# Altium schematic sheet CONNECTOR_B.SchDoc: =project_title
size Tabloid; CompanyName: Luxonis Holding; Organization: Luxonis Holding; Address1: 1925 Harmony Park Drive; Address2: Westminster, CO; Address3: 80234; Address4: United States; SheetNumber: 6; SheetTotal: 15
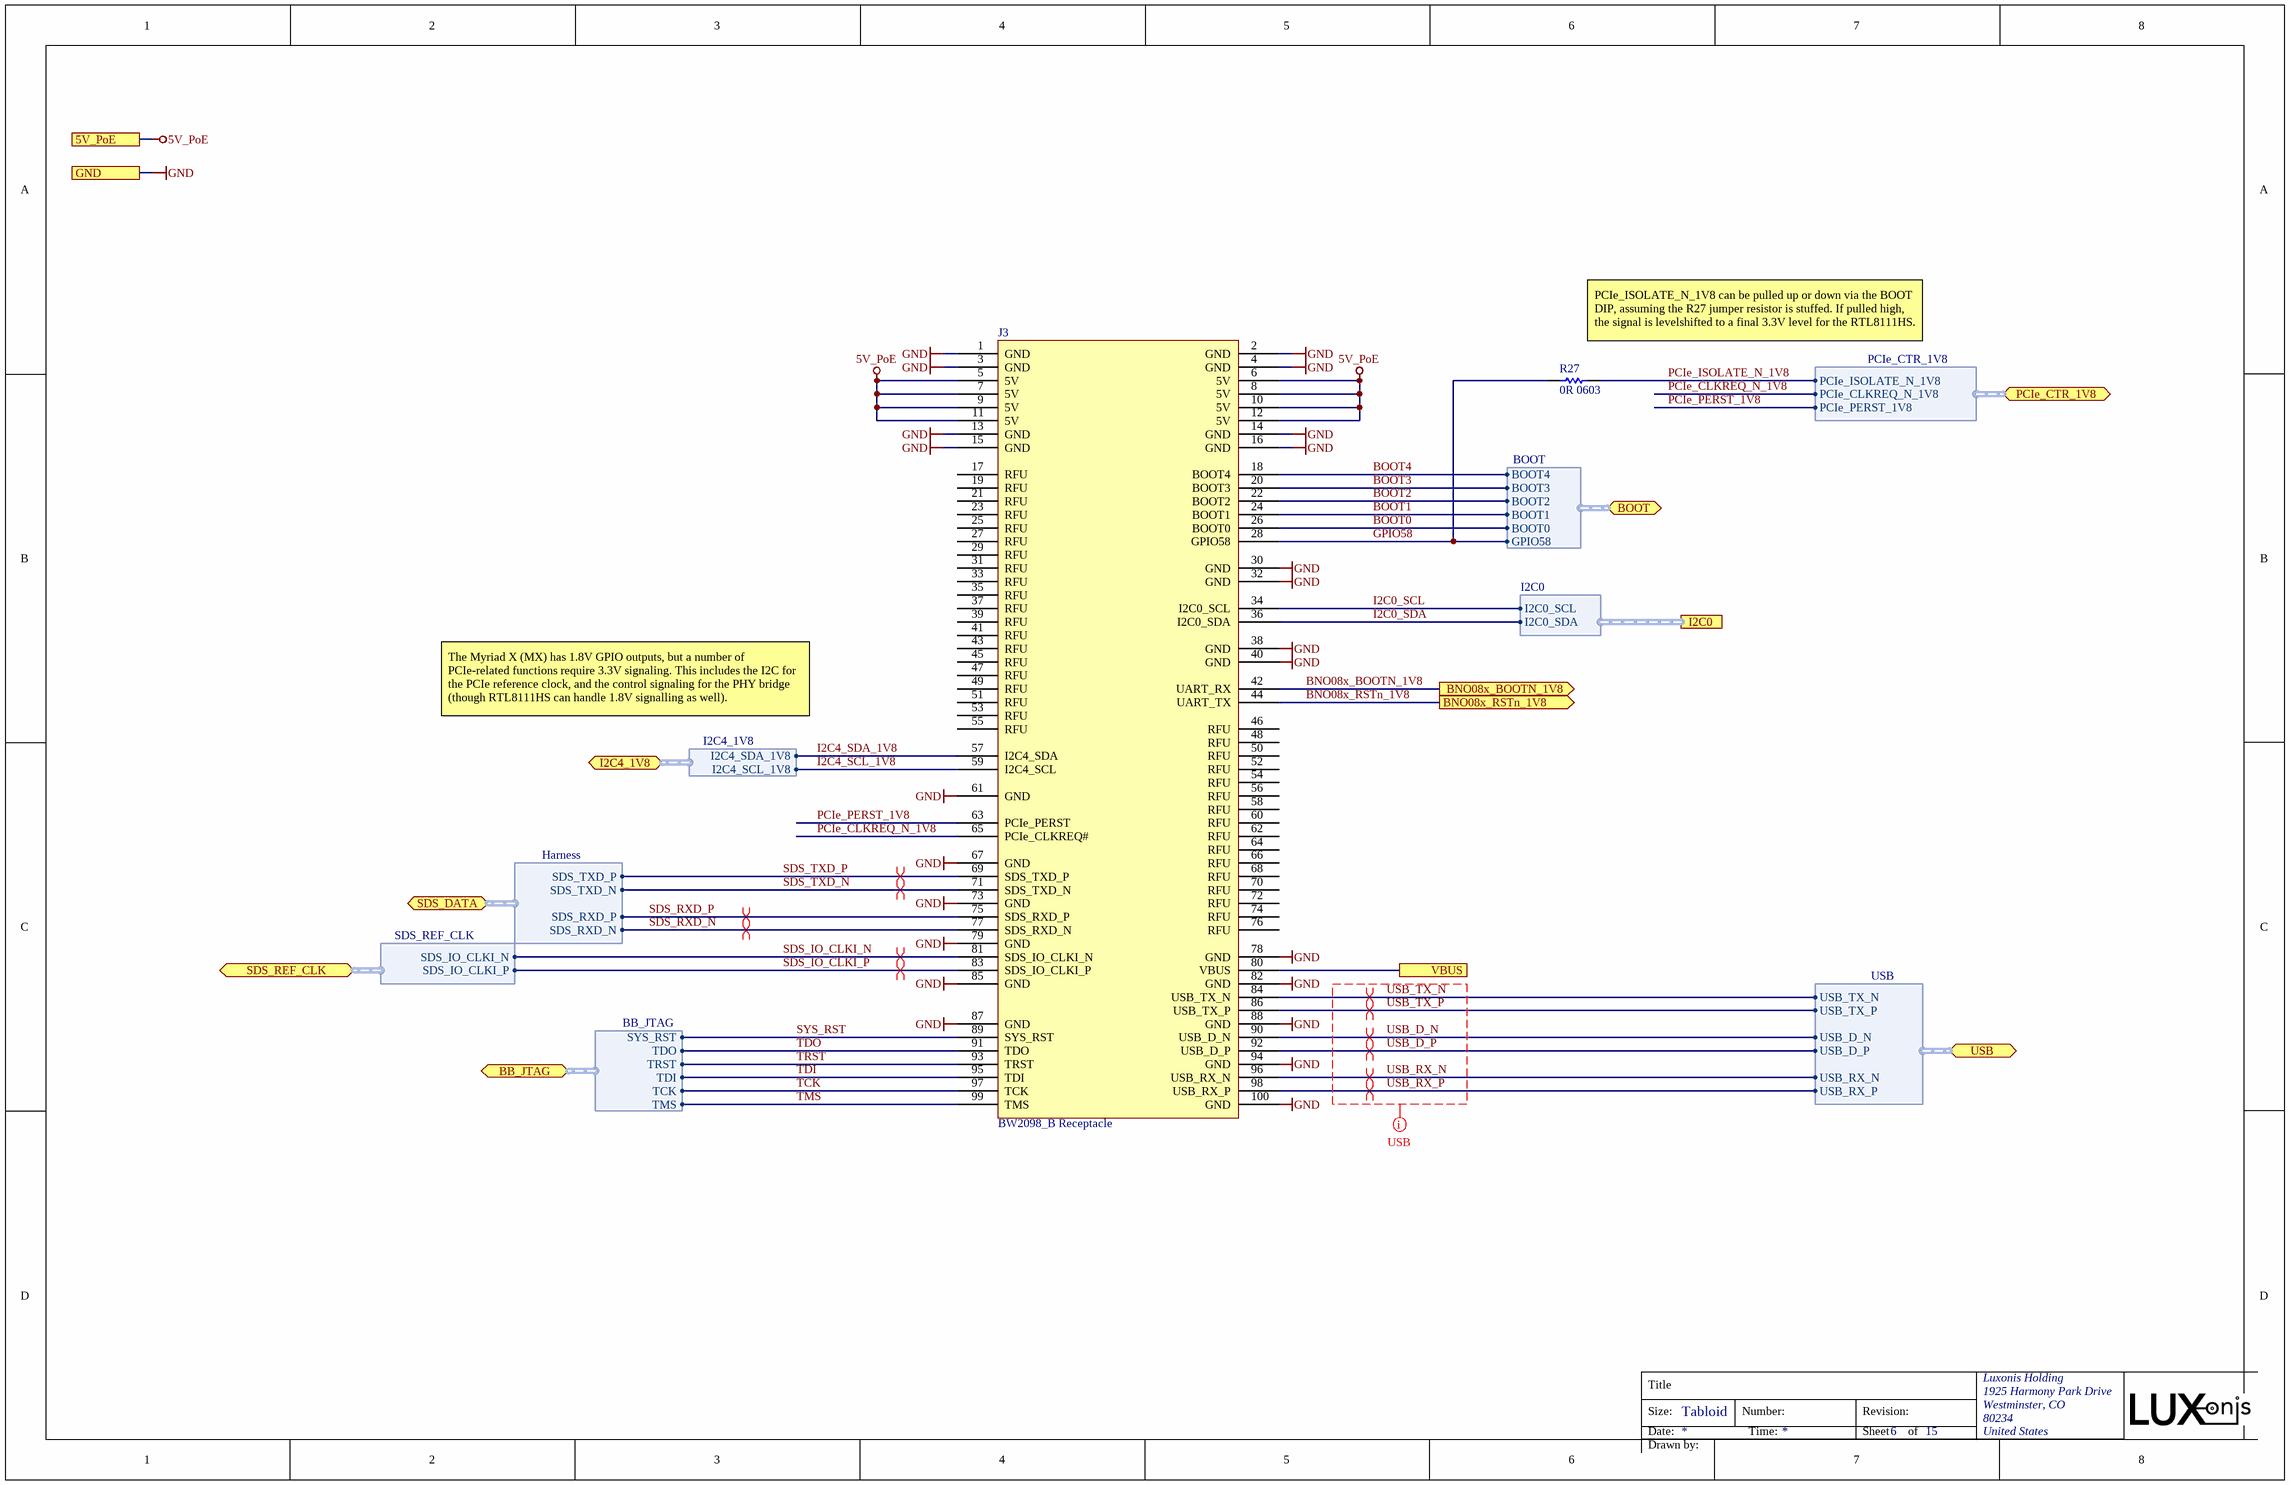
[diagram p0: CONNECTOR_B.SchDoc]

## Parts
J3  BW2098_B Receptacle  [DF40HC-3.0-100DS-0.4V_minpad]
R27  0R 0603  [RESC0603(1608)_N]

## Ports
5V_PoE, BB_JTAG (bidir, harness BB_JTAG), BNO08x_BOOTN_1V8 (out), BNO08x_RSTn_1V8 (out), BOOT (bidir, harness BOOT), GND, I2C0 (harness I2C0), I2C4_1V8 (bidir, harness I2C4_1V8), PCIe_CTR_1V8 (bidir, harness PCIe_CTR_1V8), SDS_DATA (bidir, harness Harness), SDS_REF_CLK (bidir, harness SDS_REF_CLK), USB (bidir, harness USB), VBUS

## Harnesses
USB: USB_RX_P, USB_RX_N, USB_D_P, USB_D_N, USB_TX_P, USB_TX_N
BOOT: BOOT4, BOOT3, BOOT2, BOOT1, BOOT0, GPIO58
I2C0: I2C0_SDA, I2C0_SCL
BB_JTAG: SYS_RST, TDO, TRST, TDI, TCK, TMS
SDS_REF_CLK: SDS_IO_CLKI_P, SDS_IO_CLKI_N
Harness: SDS_TXD_P, SDS_TXD_N, SDS_RXD_P, SDS_RXD_N
I2C4_1V8: I2C4_SDA_1V8, I2C4_SCL_1V8
PCIe_CTR_1V8: PCIe_CLKREQ_N_1V8, PCIe_ISOLATE_N_1V8, PCIe_PERST_1V8

## Nets
5V_PoE: J3.5(5V) J3.6(5V) J3.7(5V) J3.8(5V) J3.9(5V) J3.10(5V) J3.11(5V) J3.12(5V) ; port 5V_PoE
GND: J3.1(GND) J3.2(GND) J3.3(GND) J3.4(GND) J3.13(GND) J3.14(GND) J3.15(GND) J3.16(GND) J3.30(GND) J3.32(GND) J3.38(GND) J3.40(GND) J3.61(GND) J3.67(GND) J3.73(GND) J3.78(GND) J3.79(GND) J3.82(GND) J3.85(GND) J3.87(GND) J3.88(GND) J3.94(GND) J3.100(GND) ; port GND
BNO08x_BOOTN_1V8: J3.42(UART_RX) ; port BNO08x_BOOTN_1V8
BNO08x_RSTn_1V8: J3.44(UART_TX) ; port BNO08x_RSTn_1V8
BOOT0: J3.26(BOOT0) ; port BOOT.BOOT0
BOOT1: J3.24(BOOT1) ; port BOOT.BOOT1
BOOT2: J3.22(BOOT2) ; port BOOT.BOOT2
BOOT3: J3.20(BOOT3) ; port BOOT.BOOT3
BOOT4: J3.18(BOOT4) ; port BOOT.BOOT4
GPIO58: J3.28(GPIO58) R27.1 ; port BOOT.GPIO58
I2C0_SCL: J3.34(I2C0_SCL) ; port I2C0.I2C0_SCL
I2C0_SDA: J3.36(I2C0_SDA) ; port I2C0.I2C0_SDA
I2C4_SCL_1V8: J3.59(I2C4_SCL) ; port I2C4_1V8.I2C4_SCL_1V8
I2C4_SDA_1V8: J3.57(I2C4_SDA) ; port I2C4_1V8.I2C4_SDA_1V8
PCIe_CLKREQ_N_1V8: J3.65(PCIe_CLKREQ#) ; port PCIe_CTR_1V8.PCIe_CLKREQ_N_1V8
PCIe_ISOLATE_N_1V8: R27.2 ; port PCIe_CTR_1V8.PCIe_ISOLATE_N_1V8
PCIe_PERST_1V8: J3.63(PCIe_PERST) ; port PCIe_CTR_1V8.PCIe_PERST_1V8
SDS_IO_CLKI_N: J3.81(SDS_IO_CLKI_N) ; port SDS_REF_CLK.SDS_IO_CLKI_N
SDS_IO_CLKI_P: J3.83(SDS_IO_CLKI_P) ; port SDS_REF_CLK.SDS_IO_CLKI_P
SDS_RXD_N: J3.77(SDS_RXD_N) ; port SDS_DATA.SDS_RXD_N
SDS_RXD_P: J3.75(SDS_RXD_P) ; port SDS_DATA.SDS_RXD_P
SDS_TXD_N: J3.71(SDS_TXD_N) ; port SDS_DATA.SDS_TXD_N
SDS_TXD_P: J3.69(SDS_TXD_P) ; port SDS_DATA.SDS_TXD_P
SYS_RST: J3.89(SYS_RST) ; port BB_JTAG.SYS_RST
TCK: J3.97(TCK) ; port BB_JTAG.TCK
TDI: J3.95(TDI) ; port BB_JTAG.TDI
TDO: J3.91(TDO) ; port BB_JTAG.TDO
TMS: J3.99(TMS) ; port BB_JTAG.TMS
TRST: J3.93(TRST) ; port BB_JTAG.TRST
USB_D_N: J3.90(USB_D_N) ; port USB.USB_D_N
USB_D_P: J3.92(USB_D_P) ; port USB.USB_D_P
USB_RX_N: J3.96(USB_RX_N) ; port USB.USB_RX_N
USB_RX_P: J3.98(USB_RX_P) ; port USB.USB_RX_P
USB_TX_N: J3.84(USB_TX_N) ; port USB.USB_TX_N
USB_TX_P: J3.86(USB_TX_P) ; port USB.USB_TX_P
VBUS: J3.80(VBUS) ; port VBUS

Not connected (* = marked no-connect by the designer): J3 17(RFU) 19(RFU) 21(RFU) 23(RFU) 25(RFU) 27(RFU) 29(RFU) 31(RFU) 33(RFU) 35(RFU) 37(RFU) 39(RFU) 41(RFU) 43(RFU) 45(RFU) 46(RFU) 47(RFU) 48(RFU) 49(RFU) 50(RFU) 51(RFU) 52(RFU) 53(RFU) 54(RFU) 55(RFU) 56(RFU) 58(RFU) 60(RFU) 62(RFU) 64(RFU) 66(RFU) 68(RFU) 70(RFU) 72(RFU) 74(RFU) 76(RFU)

## Layout directives
net class USB: USB_D_N, USB_D_P, USB_RX_N, USB_RX_P, USB_TX_N, USB_TX_P
differential pair; differential pair class 100ohm: SDS_IO_CLKI_N, SDS_IO_CLKI_P, SDS_RXD_N, SDS_RXD_P, SDS_TXD_N, SDS_TXD_P
differential pair; differential pair class USB3: USB_D_N, USB_D_P, USB_RX_N, USB_RX_P, USB_TX_N, USB_TX_P

## Notes on the sheet
- PCIe_ISOLATE_N is wired up on the MV0247 via GPIO58, but does not exist in the MV0235 design.
- (near R27) PCIe_ISOLATE_N_1V8 can be pulled up or down via the BOOT DIP, assuming the R27 jumper resistor is stuffed. If pulled high, the signal is levelshifted to a final 3.3V level for the RTL8111HS.
- The Myriad X (MX) has 1.8V GPIO outputs, but a number of PCIe-related functions require 3.3V signaling. This includes the I2C for the PCIe reference clock, and the control signaling for the PHY bridge (though RTL8111HS can handle 1.8V signalling as well).
- Title
- Size:
- Date:
- Tabloid
- Number:
- Time:
- Revision:
- Sheet
- of
- Drawn by:

## Library data of the parts
J3 = DF40HC(3.0)-100DS-0.4V_BW2098_B: CONN RCPT 100POS 0.4MM SMD GOLD BW2098_B Receptacle; Manufacturer 1: Hirose; Manufacturer Part Number 1: DF40HC(3.0)-100DS-0.4V(58; Number of Positions: 100; Pitch: 0.016inch; System: Connector; RoHS: Yes; Mount: Surface Mount; Contact Plating: Gold; Packaging: Tape and Reel; Number of Rows: 2; Package Quantity: 1000; Connector Type: Receptacle; Lead Free: Lead Free; ComponentLink1URL: https://datasheet.ciiva.com/46636/ed-df40-20140305-46636517.pdf?src-supplier=Digi-Key; ComponentLink1Description: https://datasheet.ciiva.com/46636/ed-df40-20140305-46636517.pdf?src-supplier=Digi-Key; ComponentLink2URL: https://datasheet.ciiva.com/18562/ed-df40-20140305-18562189.pdf?src-supplier=Digi-Key; ComponentLink2Description: https://datasheet.ciiva.com/18562/ed-df40-20140305-18562189.pdf?src-supplier=Digi-Key; ComponentLink3URL: https://datasheet.ciiva.com/13559/ed-df40-20140305-13559540.pdf?src-supplier=Mouser; ComponentLink3Description: https://datasheet.ciiva.com/13559/ed-df40-20140305-13559540.pdf?src-supplier=Mouser; ComponentLink4URL: https://datasheet.ciiva.com/18562/ed-df40-20140305-18562462.pdf?src-supplier=Digi-Key; ComponentLink4Description: https://datasheet.ciiva.com/18562/ed-df40-20140305-18562462.pdf?src-supplier=Digi-Key; Supplier 1: Mouser; Stock 1: 2172; Pricing 1: 1=2.54000, 10=2.26000, 25=2.07000, 50=2.07000, 100=1.98000, 250=1.79000, 500=1.65000, 1000=1.41000, 3000=1.32000, 6000=1.23000, 10000=1.23000 (USD); Supplier 2: Mouser; Manufacturer 2: Hirose; Manufacturer Part Number 2: DF40HC(3.0)-100DS-0.4V(58); Stock 2: 2078; Pricing 2: 1=2.50000, 10=2.40000, 25=2.10000, 50=2.10000, 100=2.00000, 250=1.76000, 500=1.71000, 1000=1.45000, 2000=1.36000, 5000=1.31000, 10000=1.31000 (USD); Supplier Part Number 1: 798-DF40HC30100DS451; Supplier Part Number 2: 798-DF40HC30100DS458
R27 = CRCW06030000Z0EA: RES SMD 0 OHM JUMPER 1/10W 0603 0 Ohms Jumper 0.1W, 1/10W Chip Resistor 0603 (1608 Metric) Automotive AEC-Q200 Thick Film; Manufacturer 1: Vishay; Manufacturer Part Number 1: CRCW0603-0000Z0EA; Resistance: 0mR; Power Rating: 100mW; Voltage Rating: 75V; Temperature Coefficient: 100ppm/°C; Tolerance: 5%; Current Rating: 2A; Supplier 1: Digi-Key; Stock 1: 742743; Pricing 1: 1=0.100000, 10=0.034000, 25=0.024400, 50=0.018600, 100=0.013800, 250=0.010480, 500=0.008400, 1000=0.006180 (USD); RoHS: Yes; Mount: Surface Mount; Case/Package: 0603; Weight: 7.1E-05oz; Contact Plating: Tin,Lead; Case Code (Metric): 1608; Case Code (Imperial): 0603; Min Operating Temperature: -55°C; Max Operating Temperature: 155°C; Composition: Thick Film; Termination: SMD/SMT; Packaging: Tape and Reel; Package Quantity: 1; Number of Terminations: 2; Military Standard: Not; Max Power Dissipation: 100mW; Voltage Rating (DC): 75V; Features: Automotive AEC-Q200; Working Voltage: 75V; Length: 1.55mm; Height: 0.02inch; Width: 0.033inch; Depth: 0.85mm; Radiation Hardening: No; Lead Free: Lead Free; REACH SVHC: Unknown; ComponentLink1URL: https://datasheet.ciiva.com/2461/dcrcwe3-2461968.pdf?src-supplier=Digi-Key; ComponentLink1Description: https://datasheet.ciiva.com/2461/dcrcwe3-2461968.pdf?src-supplier=Digi-Key; ComponentLink2URL: https://datasheet.ciiva.com/2461/dcrcwe3-2461969.pdf?src-supplier=Digi-Key; ComponentLink2Description: https://datasheet.ciiva.com/2461/dcrcwe3-2461969.pdf?src-supplier=Digi-Key; ComponentLink3URL: https://datasheet.ciiva.com/2461/dcrcwe3-2461970.pdf?src-supplier=Digi-Key; ComponentLink3Description: https://datasheet.ciiva.com/2461/dcrcwe3-2461970.pdf?src-supplier=Digi-Key; ComponentLink4URL: https://datasheet.ciiva.com/8340/dcrcwe3-8340197.pdf?src-supplier=Avnet; ComponentLink4Description: https://datasheet.ciiva.com/8340/dcrcwe3-8340197.pdf?src-supplier=Avnet; ComponentLink5URL: https://datasheet.ciiva.com/16941/dcrcw-16941302.pdf?src-supplier=Avnet+Europe; ComponentLink5Description: https://datasheet.ciiva.com/16941/dcrcw-16941302.pdf?src-supplier=Avnet+Europe; ComponentLink6URL: https://datasheet.ciiva.com/16199/dcrcwe3-16199063.pdf?src-supplier=Future+Electronics; ComponentLink6Description: https://datasheet.ciiva.com/16199/dcrcwe3-16199063.pdf?src-supplier=Future+Electronics; ComponentLink7URL: https://datasheet.ciiva.com/16725/70201119-16725175.pdf?src-supplier=Allied+Electronics; ComponentLink7Description: https://datasheet.ciiva.com/16725/70201119-16725175.pdf?src-supplier=Allied+Electronics; ComponentLink8URL: https://datasheet.ciiva.com/26316/fld-crcw-e3-data-en-26316615.pdf?src-supplier=Distrelec; ComponentLink8Description: https://datasheet.ciiva.com/26316/fld-crcw-e3-data-en-26316615.pdf?src-supplier=Distrelec; ComponentLink9URL: https://datasheet.ciiva.com/5544/dcrcwe3-109170-5544344.pdf?src-supplier=Mouser; ComponentLink9Description: https://datasheet.ciiva.com/5544/dcrcwe3-109170-5544344.pdf?src-supplier=Mouser; ComponentLink10URL: https://datasheet.ciiva.com/7841/1720486-7841816.pdf?src-supplier=Element14; ComponentLink10Description: https://datasheet.ciiva.com/7841/1720486-7841816.pdf?src-supplier=Element14; ComponentLink11URL: https://datasheet.ciiva.com/7841/1720486-7841817.pdf?src-supplier=Element14; ComponentLink11Description: https://datasheet.ciiva.com/7841/1720486-7841817.pdf?src-supplier=Element14; ComponentLink12URL: https://datasheet.ciiva.com/7841/125364-7841818.pdf?src-supplier=Element14; ComponentLink12Description: https://datasheet.ciiva.com/7841/125364-7841818.pdf?src-supplier=Element14; ComponentLink13URL: https://datasheet.ciiva.com/16721/70201119-16721450.pdf?src-supplier=Allied+Electronics; ComponentLink13Description: https://datasheet.ciiva.com/16721/70201119-16721450.pdf?src-supplier=Allied+Electronics; Supplier Part Number 1: 541-0.0GCT-ND